# Altium schematic sheet PAGE2 - PWR, MODULE.SchDoc (part 1 of 3)
size A2; DocumentNumber: 2; SheetNumber: 2; SheetTotal: 4
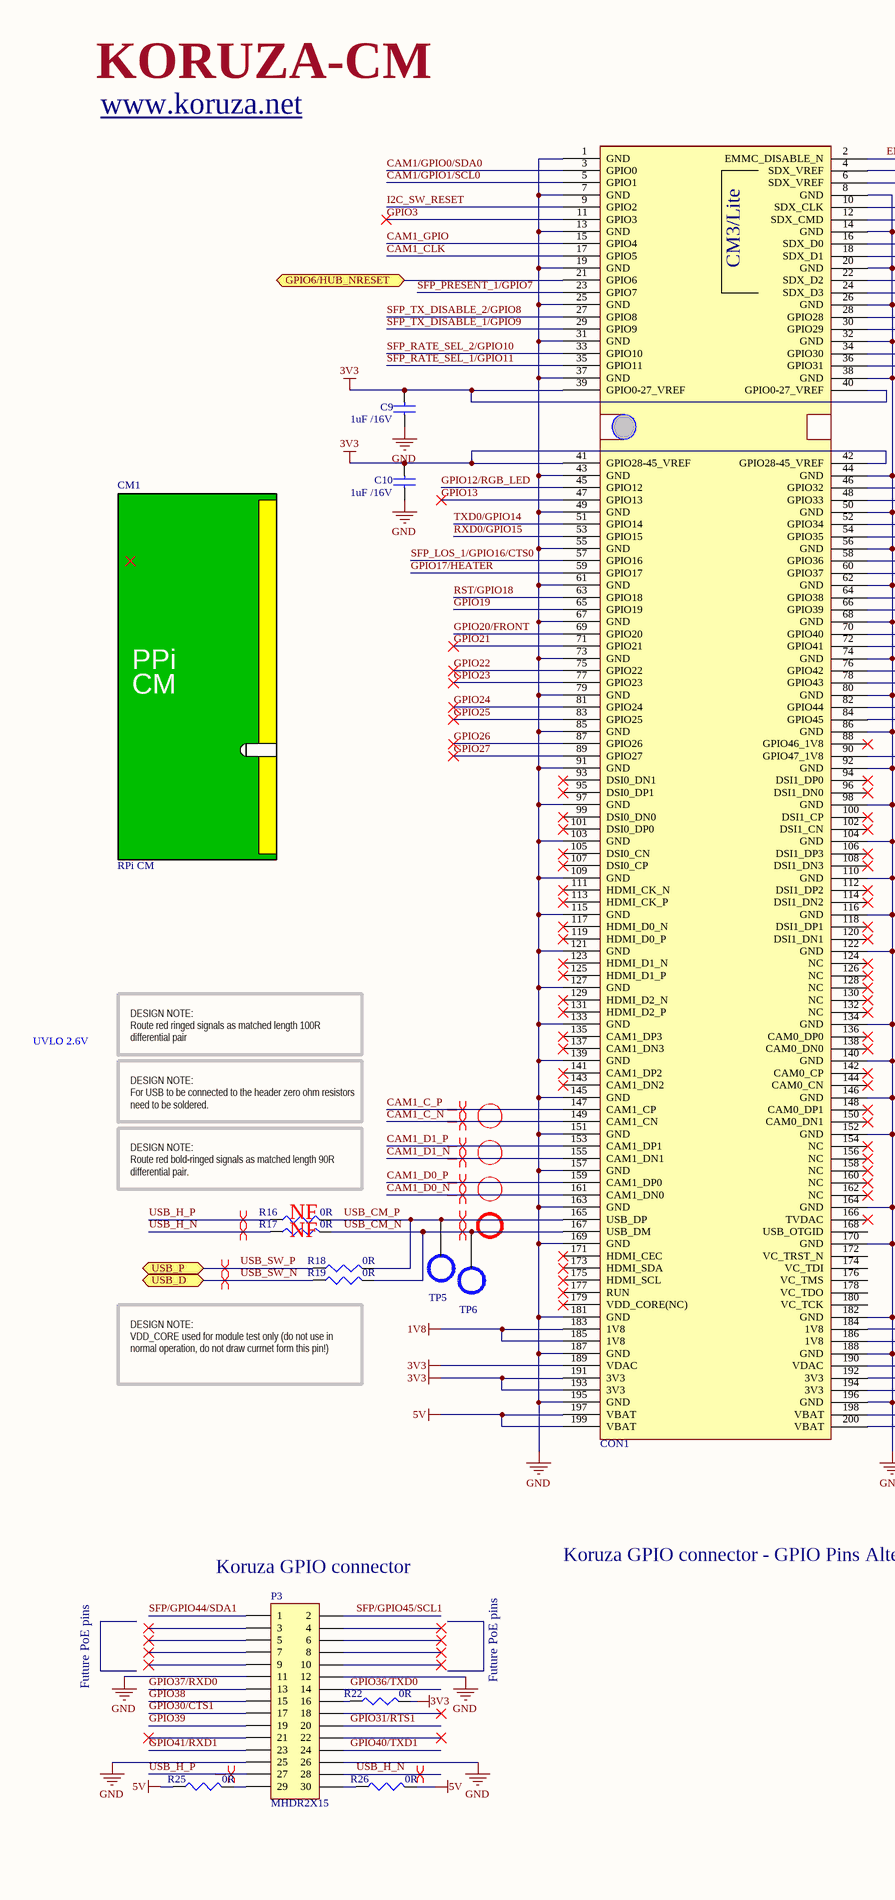
[diagram p0: PAGE2 - PWR, MODULE.SchDoc, left]
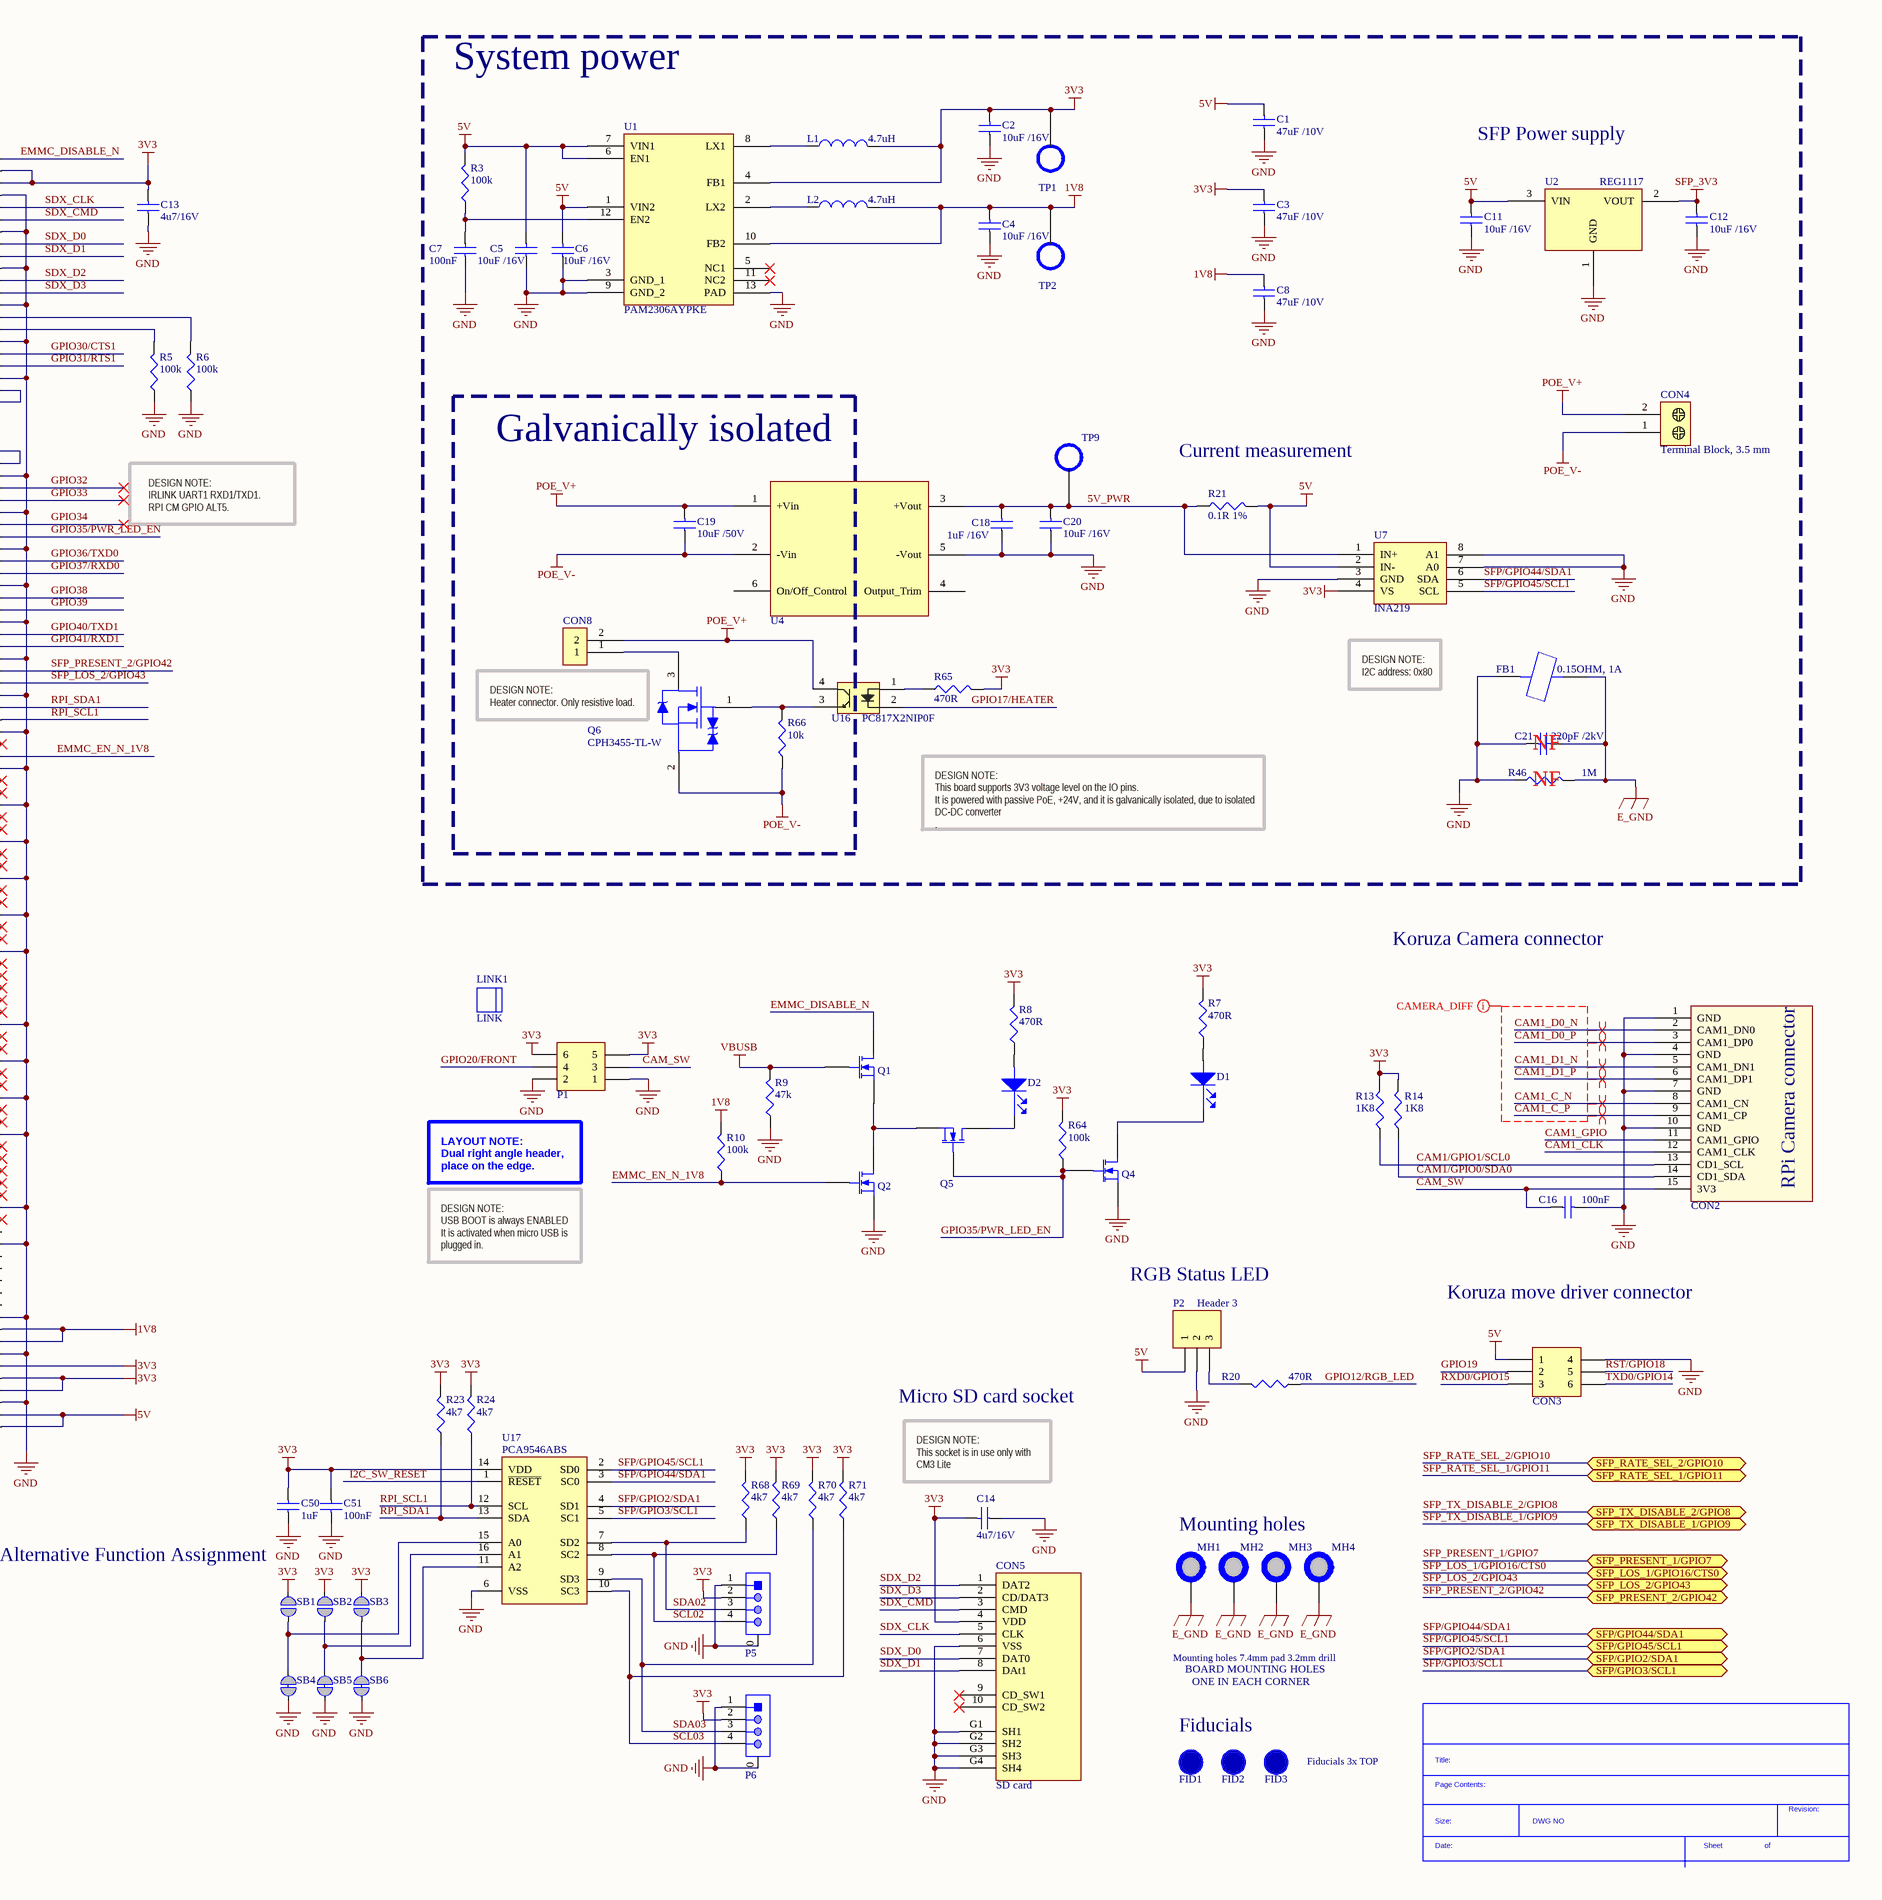
[diagram p1: PAGE2 - PWR, MODULE.SchDoc, right]

## Parts
*?  SDTitleBlock  (value not drawn)  (graphical)
C1  47uF /10V  [CAP0805]
C2  10uF /16V  [CAP0805]
C3  47uF /10V  [CAP0805]
C4  10uF /16V  [CAP0805]
C5  10uF /16V  [CAP0805]
C6  10uF /16V  [CAP0805]
C7  100nF  [CAP0603]
C8  47uF /10V  [CAP0805]
C9  1uF /16V  [CAP0603]
C10  1uF /16V  [CAP0603]
C11  10uF /16V  [CAP0603]
C12  10uF /16V  [CAP0603]
C13  4u7/16V  [CAP0603]
C14  4u7/16V  [CAP0603]
C16  100nF  [CAP0603]
C18  1uF /16V  [CAP0805]
C19  10uF /50V  [CAP1206]
C20  10uF /16V  [CAP0805]
C21  220pF /2kV  [CAP1206]
C50  1uF  [CAP0603]
C51  100nF  [CAP0603]
CM1  RPi CM  (mechanical)
CON1  1473005-4  [BTB-SM0-6-2V200]  (value not drawn)
CON2  1-1734248-5  [1-1734248-5]  (value not drawn)
CON3  MICROMATCH 6 SMD  [MICROMATCH2X3]  (value not drawn)
CON4  Terminal Block, 3.5 mm  [Block Terminal 3.5mm]
CON5  SD card  [MICRO SD CARD SOCKET]
CON8  68001-402HLF  [Hdr1x2_2.54mm]  (value not drawn)
D1  LED RED  [LED0603]  (value not drawn)
D2  LED RED  [LED0603]  (value not drawn)
FB1  0.15OHM, 1A  [CAP0805]
FID1  FID_1MMC  [FID_40X120D]  (value not drawn)  (no BOM)
FID2  FID_1MMC  [FID_40X120D]  (value not drawn)  (no BOM)
FID3  FID_1MMC  [FID_40X120D]  (value not drawn)  (no BOM)
L1  value 4.7uH  [INDP4040X18N]  (hidden comment: SRN4018-4R7M)
L2  value 4.7uH  [INDP4040X18N]  (hidden comment: SRN4018-4R7M)
LINK1  LINK  [JUMPER]  (mechanical)
MH1  MH_7.4MMNC_3.2MMD  [MH_7.4MMD_3.2MMD_NON_COPPER_NPTH]  (value not drawn)  (no BOM)
MH2  MH_7.4MMNC_3.2MMD  [MH_7.4MMD_3.2MMD_NON_COPPER_NPTH]  (value not drawn)  (no BOM)
MH3  MH_7.4MMNC_3.2MMD  [MH_7.4MMD_3.2MMD_NON_COPPER_NPTH]  (value not drawn)  (no BOM)
MH4  MH_7.4MMNC_3.2MMD  [MH_7.4MMD_3.2MMD_NON_COPPER_NPTH]  (value not drawn)  (no BOM)
P1  MHDR2X3H  [HDR2X3_2.54MM_ANGLE]  (value not drawn)  (no BOM)
P2  Header 3  [JST1X3_2.54MM]
P3  MHDR2X15  [HDR2X15]  (no BOM)
P5  BM04B-SRSS-TB(LF)(SN)  [BM04B-SRSS]  (value not drawn)
P6  BM04B-SRSS-TB(LF)(SN)  [BM04B-SRSS]  (value not drawn)
Q1  DMG1012T-7  [DMG1012T-7]  (value not drawn)
Q2  DMG1012T-7  [DMG1012T-7]  (value not drawn)
Q4  DMG1012T-7  [DMG1012T-7]  (value not drawn)
Q5  DMG1012T-7  [DMG1012T-7]  (value not drawn)
Q6  CPH3455-TL-W  [SOT23127P600-8N - 1]
R3  100k  [RES0603]
R5  100k  [RES0603]
R6  100k  [RES0603]
R7  470R  [RES0603]
R8  470R  [RES0603]
R9  47k  [RES0603]
R10  100k  [RES0603]
R13  1K8  [RES0603]
R14  1K8  [RES0603]
R16  0R  [RES0603]
R17  0R  [RES0603]
R18  0R  [RES0603]
R19  0R  [RES0603]
R20  470R  [RES0603]
R21  0.1R 1%  [RES1206]
R22  0R  [RES0603]
R23  4k7  [RES0603]
R24  4k7  [RES0603]
R25  0R  [RES0603]
R26  0R  [RES0603]
R46  1M  [RES0603]
R64  100k  [RES0603]
R65  470R  [RES0603]
R66  10k  [RES0603]
R68  4k7  [RES0603]
R69  4k7  [RES0603]
R70  4k7  [RES0603]
R71  4k7  [RES0603]
SB1  Solderbridge  [Solderbridge]  (value not drawn)  (no BOM)
SB2  Solderbridge  [Solderbridge]  (value not drawn)  (no BOM)
SB3  Solderbridge  [Solderbridge]  (value not drawn)  (no BOM)
SB4  Solderbridge  [Solderbridge_Shorted]  (value not drawn)  (net tie, no BOM)
SB5  Solderbridge  [Solderbridge_Shorted]  (value not drawn)  (net tie, no BOM)
SB6  Solderbridge  [Solderbridge_Shorted]  (value not drawn)  (net tie, no BOM)
TP1  TEST_POINT  [TEST_POINT]  (value not drawn)  (no BOM)
TP2  TEST_POINT  [TEST_POINT]  (value not drawn)  (no BOM)
TP5  TEST_POINT  [TEST_POINT]  (value not drawn)  (no BOM)
TP6  TEST_POINT  [TEST_POINT]  (value not drawn)  (no BOM)
TP9  TEST_POINT  [TEST_POINT]  (value not drawn)  (no BOM)
U1  PAM2306AYPKE  [WDFN12L]
U2  REG1117  [TI-DCY4_N]
U4  SPM15-050-Q12P-C  [DCDC_M2]  (value not drawn)
U7  INA219  [SOT23-8PIN]
U16  PC817X2NIP0F  [SOP127P600-8N]
U17  PCA9546ABS  [HVQFN16]

## Blocks framed on the sheet
System power: C1-C8 C11 C12 C18 C20 C21 CON4 FB1 L1 L2 R3 R21 R46 R65 TP1 TP2 TP9 U1 U2 U7 U16
Galvanically isolated: C19 CON8 Q6 R66 U4

## Ports
GPIO6/HUB_NRESET (bidir), SFP/GPIO2/SDA1 (bidir), SFP/GPIO3/SCL1 (bidir), SFP/GPIO44/SDA1 (bidir), SFP/GPIO45/SCL1 (bidir), SFP_LOS_1/GPIO16/CTS0 (bidir), SFP_LOS_2/GPIO43 (bidir), SFP_PRESENT_1/GPIO7 (bidir), SFP_PRESENT_2/GPIO42 (bidir), SFP_RATE_SEL_1/GPIO11 (bidir), SFP_RATE_SEL_2/GPIO10 (bidir), SFP_TX_DISABLE_1/GPIO9 (bidir), SFP_TX_DISABLE_2/GPIO8 (bidir), USB_D (bidir), USB_P (bidir)

## Nets
1V8: C4.2 C8.2 CON1.183(1V8) CON1.184(1V8) CON1.185(1V8) CON1.186(1V8) L2.2 R10.2 TP2.1(TP) U1.10(FB2)
3V3: C2.2 C3.2 C9.2 C10.2 C13.2 C14.2 C50.2 C51.2 CON1.4(SDX_VREF) CON1.6(SDX_VREF) CON1.39(GPIO0-27_VREF) CON1.40(GPIO0-27_VREF) CON1.41(GPIO28-45_VREF) CON1.42(GPIO28-45_VREF) CON1.189(VDAC) CON1.190(VDAC) CON1.191(3V3) CON1.192(3V3) CON1.193(3V3) CON1.194(3V3) CON5.4(VDD) L1.2 P1.5 P1.6 P5.2 P6.2 R7.2 R8.2 R13.2 R14.2 R22.2 R23.2 R24.2 R64.2 R65.2 R68.2 R69.2 R70.2 R71.2 SB1.1 SB2.1 SB3.1 TP1.1(TP) U1.4(FB1) U7.4(VS) U17.14(VDD)
5V: C1.2 C5.2 C6.2 C11.2 CON1.197(VBAT) CON1.198(VBAT) CON1.199(VBAT) CON1.200(VBAT) CON3.1 P2.1 R3.2 R21.2 R25.1 R26.2 U1.1(VIN2) U1.6(EN1) U1.7(VIN1) U2.3(VIN) U7.2(IN-)
E_GND: C21.2 FB1.2 MH1.1 MH2.1 MH3.1 MH4.1 R46.2
GND: C1.1 C2.1 C3.1 C4.1 C5.1 C6.1 C7.1 C8.1 C9.1 C10.1 C11.1 C12.1 C13.1 C14.1 C16.2 C18.1 C20.1 C21.1 C50.1 C51.1 CON1.1(GND) CON1.7(GND) CON1.8(GND) CON1.13(GND) CON1.14(GND) CON1.19(GND) CON1.20(GND) CON1.25(GND) CON1.26(GND) CON1.31(GND) CON1.32(GND) CON1.37(GND) CON1.38(GND) CON1.43(GND) CON1.44(GND) CON1.49(GND) CON1.50(GND) CON1.55(GND) CON1.56(GND) CON1.61(GND) CON1.62(GND) CON1.67(GND) CON1.68(GND) CON1.73(GND) CON1.74(GND) CON1.79(GND) CON1.80(GND) CON1.85(GND) CON1.86(GND) CON1.91(GND) CON1.92(GND) CON1.97(GND) CON1.98(GND) CON1.103(GND) CON1.104(GND) CON1.109(GND) CON1.110(GND) CON1.115(GND) CON1.116(GND) CON1.121(GND) CON1.122(GND) CON1.127(GND) CON1.133(GND) CON1.134(GND) CON1.139(GND) CON1.140(GND) CON1.145(GND) CON1.146(GND) CON1.151(GND) CON1.152(GND) CON1.157(GND) CON1.163(GND) CON1.164(GND) CON1.169(GND) CON1.170(GND) CON1.181(GND) CON1.182(GND) CON1.187(GND) CON1.188(GND) CON1.195(GND) CON1.196(GND) CON2.1(GND) CON2.4(GND) CON2.7(GND) CON2.10(GND) CON3.4 CON5.6(VSS) CON5.G1(SH1) CON5.G2(SH2) CON5.G3(SH3) CON5.G4(SH4) FB1.1 P1.1 P1.2 P2.2 P3.11 P3.12 P3.25 P3.26 P5.0 P5.1 P6.0 P6.1 Q2.3(S) Q4.3(S) R5.1 R6.1 R9.1 R46.1 SB4.2 SB5.2 SB6.2 U1.3(GND_1) U1.9(GND_2) U1.13(PAD) U2.1(GND) U4.5(-Vout) U7.3(GND) U7.7(A0) U7.8(A1) U17.6(VSS)
POE_V+: C19.2 CON4.2 CON8.2 U4.1(+Vin) U16.4
POE_V-: C19.1 CON4.1 Q6.2 R66.1 U4.2(-Vin)
SFP_3V3: C12.2 U2.2(VOUT)
VBUSB: Q1.2(G) R9.2
5V_PWR: C18.2 C20.2 R21.1 TP9.1(TP) U4.3(+Vout) U7.1(IN+)
CAM1/GPIO0/SDA0: CON1.3(GPIO0) CON2.14(CD1_SDA) R14.1
CAM1/GPIO1/SCL0: CON1.5(GPIO1) CON2.13(CD1_SCL) R13.1
CAM1_C_N: CON1.149(CAM1_CN) CON2.8(CAM1_CN)
CAM1_C_P: CON1.147(CAM1_CP) CON2.9(CAM1_CP)
CAM1_CLK: CON1.17(GPIO5) CON2.12(CAM1_CLK)
CAM1_D0_N: CON1.161(CAM1_DN0) CON2.2(CAM1_DN0)
CAM1_D0_P: CON1.159(CAM1_DP0) CON2.3(CAM1_DP0)
CAM1_D1_N: CON1.155(CAM1_DN1) CON2.5(CAM1_DN1)
CAM1_D1_P: CON1.153(CAM1_DP1) CON2.6(CAM1_DP1)
CAM1_GPIO: CON1.15(GPIO4) CON2.11(CAM1_GPIO)
CAM_SW: C16.1 CON2.15(3V3) P1.3
EMMC_DISABLE_N: CON1.2(EMMC_DISABLE_N) Q1.1(D)
EMMC_EN_N_1V8: CON1.90(GPIO47_1V8) Q2.2(G) R10.1
GPIO3: CON1.11(GPIO3)
GPIO6/HUB_NRESET: CON1.21(GPIO6) ; port GPIO6/HUB_NRESET
GPIO12/RGB_LED: CON1.45(GPIO12) R20.1
GPIO13: CON1.47(GPIO13)
GPIO17/HEATER: CON1.59(GPIO17) U16.2
GPIO19: CON1.65(GPIO19) CON3.2
GPIO20/FRONT: CON1.69(GPIO20) P1.4
GPIO21: CON1.71(GPIO21)
GPIO22: CON1.75(GPIO22)
GPIO23: CON1.77(GPIO23)
GPIO24: CON1.81(GPIO24)
GPIO25: CON1.83(GPIO25)
GPIO26: CON1.87(GPIO26)
GPIO27: CON1.89(GPIO27)
GPIO30/CTS1: CON1.34(GPIO30) P3.17
GPIO31/RTS1: CON1.36(GPIO31) P3.20
GPIO32: CON1.46(GPIO32)
GPIO33: CON1.48(GPIO33)
GPIO34: CON1.52(GPIO34)
GPIO35/PWR_LED_EN: CON1.54(GPIO35) Q4.2(G) Q5.2(G) R64.1
GPIO36/TXD0: CON1.58(GPIO36) P3.14
GPIO37/RXD0: CON1.60(GPIO37) P3.13
GPIO38: CON1.64(GPIO38) P3.15
GPIO39: CON1.66(GPIO39) P3.19
GPIO40/TXD1: CON1.70(GPIO40) P3.24
GPIO41/RXD1: CON1.72(GPIO41) P3.23
I2C_SW_RESET: CON1.9(GPIO2) U17.1(~{RESET})
RPI_SCL1: CON1.84(GPIO45) R24.1 U17.12(SCL)
RPI_SDA1: CON1.82(GPIO44) R23.1 U17.13(SDA)
RST/GPIO18: CON1.63(GPIO18) CON3.5
RXD0/GPIO15: CON1.53(GPIO15) CON3.3
SCL02: P5.4 R69.1 U17.8(SC2)
SCL03: P6.4 R71.1 U17.10(SC3)
SDA02: P5.3 R68.1 U17.7(SD2)
SDA03: P6.3 R70.1 U17.9(SD3)
SDX_CLK: CON1.10(SDX_CLK) CON5.5(CLK)
SDX_CMD: CON1.12(SDX_CMD) CON5.3(CMD)
SDX_D0: CON1.16(SDX_D0) CON5.7(DAT0)
SDX_D1: CON1.18(SDX_D1) CON5.8(DAt1)
SDX_D2: CON1.22(SDX_D2) CON5.1(DAT2)
SDX_D3: CON1.24(SDX_D3) CON5.2(CD/DAT3)
SFP/GPIO2/SDA1: U17.4(SD1) ; port SFP/GPIO2/SDA1
SFP/GPIO3/SCL1: U17.5(SC1) ; port SFP/GPIO3/SCL1
SFP/GPIO44/SDA1: P3.1 U7.6(SDA) U17.3(SC0) ; port SFP/GPIO44/SDA1
SFP/GPIO45/SCL1: P3.2 U7.5(SCL) U17.2(SD0) ; port SFP/GPIO45/SCL1
SFP_LOS_1/GPIO16/CTS0: CON1.57(GPIO16) ; port SFP_LOS_1/GPIO16/CTS0
SFP_LOS_2/GPIO43: CON1.78(GPIO43) ; port SFP_LOS_2/GPIO43
SFP_PRESENT_1/GPIO7: CON1.23(GPIO7) ; port SFP_PRESENT_1/GPIO7
SFP_PRESENT_2/GPIO42: CON1.76(GPIO42) ; port SFP_PRESENT_2/GPIO42
SFP_RATE_SEL_1/GPIO11: CON1.35(GPIO11) ; port SFP_RATE_SEL_1/GPIO11
SFP_RATE_SEL_2/GPIO10: CON1.33(GPIO10) ; port SFP_RATE_SEL_2/GPIO10
SFP_TX_DISABLE_1/GPIO9: CON1.29(GPIO9) ; port SFP_TX_DISABLE_1/GPIO9
SFP_TX_DISABLE_2/GPIO8: CON1.27(GPIO8) ; port SFP_TX_DISABLE_2/GPIO8
TXD0/GPIO14: CON1.51(GPIO14) CON3.6
USB_CM_N: CON1.167(USB_DM) R17.2 R19.2 TP6.1(TP)
USB_CM_P: CON1.165(USB_DP) R16.2 R18.2 TP5.1(TP)
USB_H_N: P3.28 R17.1
USB_H_P: P3.27 R16.1
USB_SW_N: R19.1 ; port USB_D
USB_SW_P: R18.1 ; port USB_P
NetC7_2: C7.2 R3.1 U1.12(EN2)
NetCON1_28: CON1.28(GPIO28) R6.2
NetCON1_30: CON1.30(GPIO29) R5.2
NetCON8_1: CON8.1 Q6.3
NetD1_1: D1.1(cathode) Q4.1(D)
NetD1_2: D1.2(ANODE) R7.1
NetD2_1: D2.1(cathode) Q5.1(D)
NetD2_2: D2.2(ANODE) R8.1
NetL1_1: L1.1 U1.8(LX1)
NetL2_1: L2.1 U1.2(LX2)
NetP2_3: P2.3 R20.2
NetP3_16: P3.16 R22.1
NetP3_29: P3.29 R25.2
NetP3_30: P3.30 R26.1
NetQ1_3: Q1.3(S) Q2.1(D) Q5.3(S)
NetQ6_1: Q6.1 R66.2 U16.3
NetR65_1: R65.1 U16.1
NetSB1_2: SB1.2 SB4.1 U17.15(A0)
NetSB2_2: SB2.2 SB5.1 U17.16(A1)
NetSB3_2: SB3.2 SB6.1 U17.11(A2)

Not connected (* = marked no-connect by the designer): CON1 88(GPIO46_1V8)* 93(DSI0_DN1)* 94(DSI1_DP0)* 95(DSI0_DP1)* 96(DSI1_DN0)* 99(DSI0_DN0)* 100(DSI1_CP)* 101(DSI0_DP0)* 102(DSI1_CN)* 105(DSI0_CN)* 106(DSI1_DP3)* 107(DSI0_CP)* 108(DSI1_DN3)* 111(HDMI_CK_N)* 112(DSI1_DP2)* 113(HDMI_CK_P)* 114(DSI1_DN2)* 117(HDMI_D0_N)* 118(DSI1_DP1)* 119(HDMI_D0_P)* 120(DSI1_DN1)* 123(HDMI_D1_N)* 124(NC)* 125(HDMI_D1_P)* 126(NC)* 128(NC)* 129(HDMI_D2_N)* 130(NC)* 131(HDMI_D2_P)* 132(NC)* 135(CAM1_DP3)* 136(CAM0_DP0)* 137(CAM1_DN3)* 138(CAM0_DN0)* 141(CAM1_DP2)* 142(CAM0_CP)* 143(CAM1_DN2)* 144(CAM0_CN)* 148(CAM0_DP1)* 150(CAM0_DN1)* 154(NC)* 156(NC)* 158(NC)* 160(NC)* 162(NC)* 166(TVDAC)* 168(USB_OTGID) 171(HDMI_CEC)* 172(VC_TRST_N) 173(HDMI_SDA)* 174(VC_TDI) 175(HDMI_SCL)* 176(VC_TMS) 177(RUN)* 178(VC_TDO) 179(VDD_CORE(NC))* 180(VC_TCK); CON5 9(CD_SW1)* 10(CD_SW2)*; P3 3* 4* 5* 6* 7* 8* 9* 10* 18* 21* 22*; U1 5(NC1)* 11(NC2)*; U4 4(Output_Trim) 6(On/Off_Control)

## Layout directives
differential pair: CAM1_C_N, CAM1_C_P, CAM1_D0_N, CAM1_D0_P, CAM1_D1_N, CAM1_D1_P, USB_CM_N, USB_CM_P, USB_H_N, USB_H_P, USB_SW_N, USB_SW_P
net class CAMERA_DIFF_100: CAM1_C_N, CAM1_C_P, CAM1_D0_N, CAM1_D0_P, CAM1_D1_N, CAM1_D1_P

## Notes on the sheet
- KORUZA-CM
- www.koruza.net
- SFP Power supply
- (near R21) Current measurement
- DESIGN NOTE:
  IRLINK UART1 RXD1/TXD1.
  RPI CM GPIO ALT5.
- (near FB1) DESIGN NOTE:
  I2C address: 0x80
- DESIGN NOTE:
  Heater connector. Only resistive load.
- (near C21) NF
- (near R46) NF
- DESIGN NOTE:
  This board supports 3V3 voltage level on the IO pins.
  It is powered with passive PoE, +24V, and it is galvanically isolated, due to isolated DC-DC converter
  .
- Koruza Camera connector
- UVLO 2.6V
- DESIGN NOTE:
  Route red ringed signals as matched length 100R differential pair
- DESIGN NOTE:
  For USB to be connected to the header zero ohm resistors need to be soldered.
- DESIGN NOTE:
  Route red bold-ringed signals as matched length 90R differential pair.
- LAYOUT NOTE:
  Dual right angle header,
  place on the edge.
- NF
- (near R16) NF
- DESIGN NOTE:
  USB BOOT is always ENABLED
  It is activated when micro USB is plugged in.
- RGB Status LED
- Koruza move driver connector
- DESIGN NOTE:
  VDD_CORE used for module test only (do not use in normal operation, do not draw currnet form this pin!)
- Micro SD card socket
- (near C14) DESIGN NOTE:
  This socket is in use only with CM3 Lite
- Mounting holes
- (near P3) Koruza GPIO connector
- Koruza GPIO connector - GPIO Pins Alternative Function Assignment
- Future PoE pins
- Mounting holes 7.4mm pad 3.2mm drill
- BOARD MOUNTING HOLES
- Fiducials
- ONE IN EACH CORNER
- (near FID3) Fiducials 3x TOP
- (in symbol Camera con 15 pin) RPi Camera connector
- (in symbol RPi CM CON) CM3/Lite
- (in symbol RPI COMPUTE MODULE) PPi; CM
- (in symbol SDTitleBlock) Title:; Page Contents:; Revision:; Size:; DWG NO; Date:; Sheet; of